# Altium schematic sheet P03-UARTs_KEY.SchDoc
size 420 x 297 mm
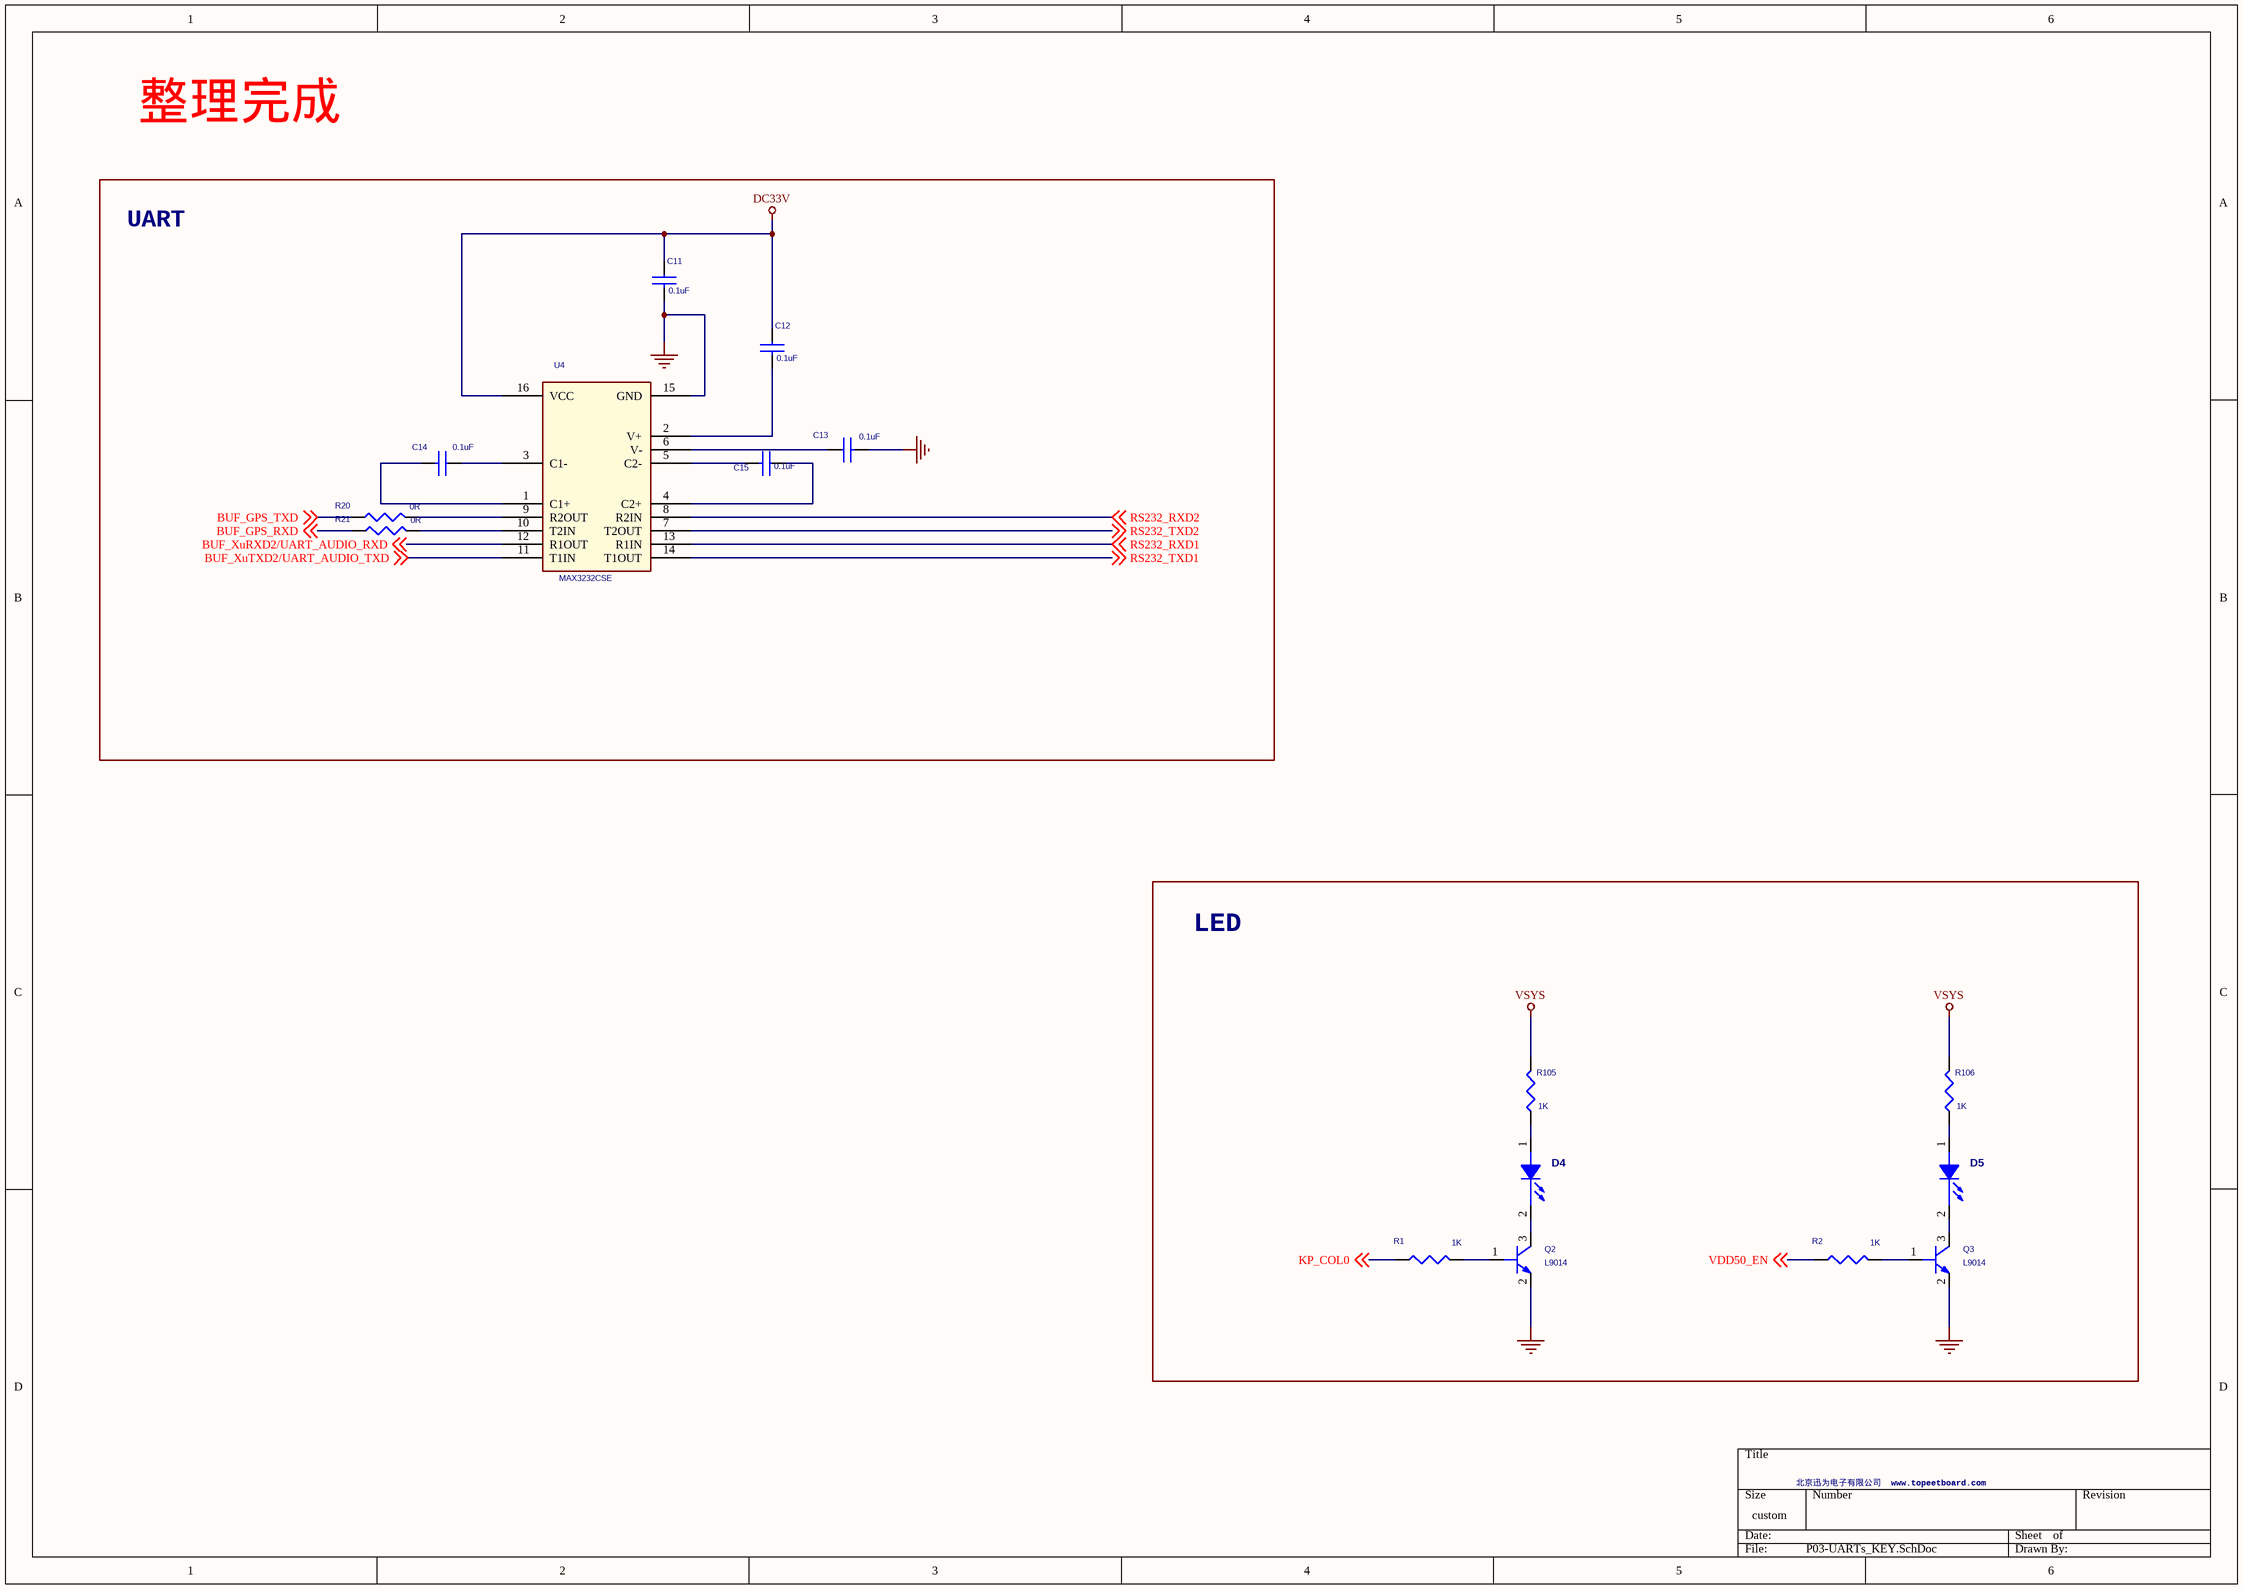
[diagram p0: P03-UARTs_KEY.SchDoc]

## Parts
C11  0.1uF  [C0603-S]
C12  0.1uF  [C0603-S]
C13  0.1uF  [C0603-S]
C14  0.1uF  [C0603-S]
C15  0.1uF  [C0603-S]
D4  LED-Red (SMD 2012)  [LED0603]  (value not drawn)
D5  LED-Red (SMD 2012)  [LED0603]  (value not drawn)
Q2  L9014  [SOT-23]
Q3  L9014  [SOT-23]
R1  1K  [R0603-S]
R2  1K  [R0603-S]
R20  0R  [R0603-S]
R21  0R  [R0603-S]
R105  1K  [R0603-S]
R106  1K  [R0603-S]
U4  MAX3232CSE  [SO-16]

## Blocks framed on the sheet
UART: C11-C15 R20 R21 U4
LED: D4 D5 Q2 Q3 R1 R2 R105 R106

## Nets
DC33V: C11.1 C12.1 U4.16(VCC)
GND: C11.2 C13.2 Q2.2(EMITTER) Q3.2(EMITTER) U4.15(GND)
VSYS: R105.2 R106.2
BUF_GPS_RXD: R21.1 ; off-sheet BUF_GPS_RXD
BUF_GPS_TXD: R20.1 ; off-sheet BUF_GPS_TXD
BUF_XuRXD2/UART_AUDIO_RXD: U4.12(R1OUT) ; off-sheet BUF_XuRXD2/UART_AUDIO_RXD
BUF_XuTXD2/UART_AUDIO_TXD: U4.11(T1IN) ; off-sheet BUF_XuTXD2/UART_AUDIO_TXD
KP_COL0: R1.2 ; off-sheet KP_COL0
RS232_RXD1: U4.13(R1IN) ; off-sheet RS232_RXD1
RS232_RXD2: U4.8(R2IN) ; off-sheet RS232_RXD2
RS232_TXD1: U4.14(T1OUT) ; off-sheet RS232_TXD1
RS232_TXD2: U4.7(T2OUT) ; off-sheet RS232_TXD2
VDD50_EN: R2.2 ; off-sheet VDD50_EN
NetC12_2: C12.2 U4.2(V+)
NetC13_1: C13.1 U4.6(V-)
NetC14_1: C14.1 U4.3(C1-)
NetC14_2: C14.2 U4.1(C1+)
NetC15_1: C15.1 U4.4(C2+)
NetC15_2: C15.2 U4.5(C2-)
NetD4_1: D4.1(ANODE) R105.1
NetD4_2: D4.2(CATHODE) Q2.3(COLLECTOR)
NetD5_1: D5.1(ANODE) R106.1
NetD5_2: D5.2(CATHODE) Q3.3(COLLECTOR)
NetQ2_1: Q2.1(BASE) R1.1
NetQ3_1: Q3.1(BASE) R2.1
NetR20_2: R20.2 U4.9(R2OUT)
NetR21_2: R21.2 U4.10(T2IN)

## Notes on the sheet
- 整理完成
- 北京迅为电子有限公司  www.topeetboard.com

## Library data of the parts
C11-C15 = C0603_0
D4 D5 = LED-RED_SMD_1
Q2 Q3 = L14P2/TO_1
R1 R2 R105 R106 = R1005_0_Dup1
R20 R21 = R1005_0
U4 = MAX3232EEAE